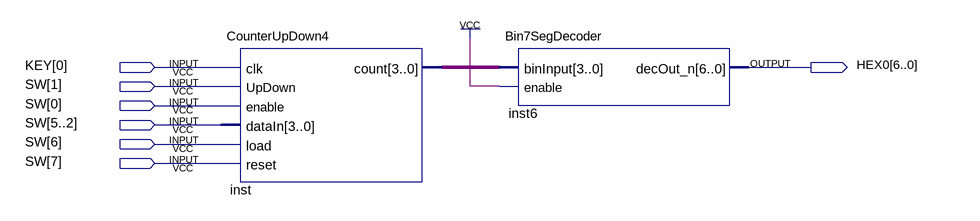
[diagram p0: schematic sheet]
// Quartus schematic Counter_Demo.bdf as structural Verilog: 2 symbols, 7 pins
module Counter_Demo (
  input  [0:0] KEY,
  input  [7:0] SW,
  output [6:0] HEX0
);

  wire [3:0] inst_count;

  CounterUpDown4 inst (
    .clk(KEY[0]), .UpDown(SW[1]), .enable(SW[0]), .dataIn(SW[5:2]), .load(SW[6]), .reset(SW[7]),
    .count(inst_count));
  Bin7SegDecoder inst6 (.binInput(inst_count), .enable(1'b1), .decOut_n(HEX0));
endmodule
